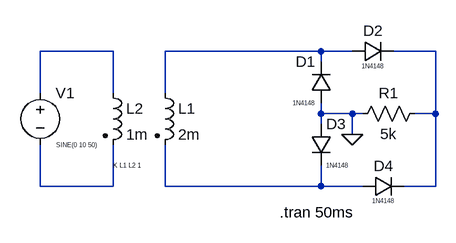
[diagram p0: schematic full wave rectifier.asc]
full wave rectifier.asc, the LTspice schematic file:
Version 4
SHEET 1 880 680
WIRE 32 144 -80 144
WIRE 352 144 112 144
WIRE 400 144 352 144
WIRE 528 144 464 144
WIRE 352 160 352 144
WIRE -80 208 -80 144
WIRE 32 208 32 144
WIRE 112 208 112 144
WIRE 352 240 352 224
WIRE 400 240 352 240
WIRE 416 240 400 240
WIRE 528 240 528 144
WIRE 528 240 496 240
WIRE 352 256 352 240
WIRE 400 272 400 240
WIRE -80 352 -80 288
WIRE 32 352 32 288
WIRE 32 352 -80 352
WIRE 112 352 112 288
WIRE 352 352 352 320
WIRE 352 352 112 352
WIRE 416 352 352 352
WIRE 528 352 528 240
WIRE 528 352 480 352
FLAG 400 272 0
SYMBOL diode 368 224 R180
WINDOW 0 24 64 Left 2
WINDOW 3 24 0 Left 0
SYMATTR InstName D1
SYMATTR Value 1N4148
SYMBOL diode 400 160 R270
WINDOW 0 32 32 VTop 2
WINDOW 3 0 32 VBottom 0
SYMATTR InstName D2
SYMATTR Value 1N4148
SYMBOL diode 336 256 R0
WINDOW 3 24 64 Left 0
SYMATTR InstName D3
SYMATTR Value 1N4148
SYMBOL diode 416 368 R270
WINDOW 0 32 32 VTop 2
WINDOW 3 0 32 VBottom 0
SYMATTR InstName D4
SYMATTR Value 1N4148
SYMBOL res 512 224 R90
WINDOW 0 0 56 VBottom 2
WINDOW 3 32 56 VTop 2
SYMATTR InstName R1
SYMATTR Value 5k
SYMBOL ind2 96 192 R0
SYMATTR InstName L1
SYMATTR Value 2m
SYMATTR Type ind
SYMBOL ind2 16 192 R0
SYMATTR InstName L2
SYMATTR Value 1m
SYMATTR Type ind
SYMBOL voltage -80 192 R0
WINDOW 3 88 96 Right 0
SYMATTR InstName V1
SYMATTR Value SINE(0 10 50)
SYMATTR SpiceLine Rser=0.1m
TEXT 288 392 Left 2 !.tran 50ms
TEXT 32 320 Left 0 !K L1 L2 1

The netlist it stands for:
* full wave rectifier.asc
D1 0 N002 1N4148
D2 N002 N003 1N4148
D3 0 N005 1N4148
D4 N005 N003 1N4148
R1 N003 0 5k
L1 N002 N005 2m
L2 N001 N004 1m
V1 N001 N004 SINE(0 10 50) Rser=0.1m
.model D D
.lib standard.dio
.tran 50ms
K L1 L2 1
.backanno
.end